# Altium project Hospital-Smart-Bracelet.PrjPcb
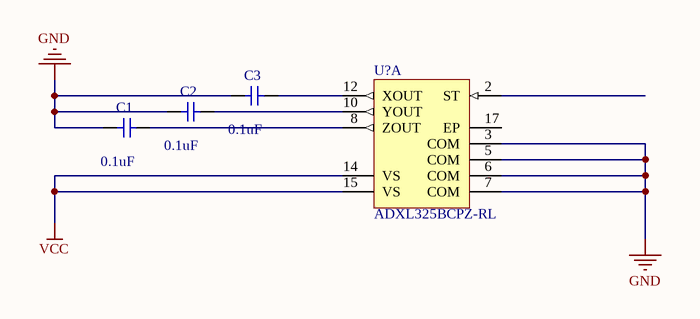
[diagram p0: SensorCaida.SchDoc]
7 sheets, 14 parts. Net scope: global (net labels, ports and power ports of the same name join across sheets).
Board file: HSB-Version1.PcbDoc
Sheets:
  SensorCaida.SchDoc
  Temperatura.SchDoc
  Atmega328P.SchDoc
  Proximidad.SchDoc
  CargaInalambrica.SchDoc
  BLE-HM10.SchDoc
  PPM.SchDoc

## Sheet SensorCaida.SchDoc
size A4

### Parts
(Parts that share a designator on the sheet are numbered #1, #2 ... from top to bottom, then left to right.)
C1  value 0.1uF  [C1206-1.00]  (hidden comment: C)
C2  value 0.1uF  [C1206-1.00]  (hidden comment: C)
C3  value 0.1uF  [C1206-1.00]  (hidden comment: C)
U?#1  ADXL325BCPZ-RL  [ADI-CP-16-5a_N]  (part A of 2)

### Nets
GND: C2.2 C3.2 U?#1.3(COM) U?#1.5(COM) U?#1.6(COM) U?#1.7(COM)
VCC: U?#1.14(VS) U?#1.15(VS)  [project net 3.3V]
NetC1_1: C1.1 U?#1.8(ZOUT)
NetC2_1: C2.1 U?#1.10(YOUT)
NetC3_1: C3.1 U?#1.12(XOUT)

Not connected (* = marked no-connect by the designer): C1 2; U?#1 2(ST) 17(EP)

### Library data of the parts
C1-C3 = C: Capacitor, generic
U?#1 = ADXL325BCPZ-RL: Small, Low Power, 3-Axis +/-5 g Accelerometer with Analog Output, 1.6 KHz BW, Industrial, 16-pin QFN, Reel; Manufacturer: Analog Devices; # of Axes: 3; -3dB Bandwidth: 1.6 KHz; Sensitivity: 174 mV/g; Supply Current: 350 uA; Voltage Supply (V): 1.8 to 3.6; DatasheetVersion: Rev. 0; PackageVersion: 072606-0, 07/2006; PackageReference: CP-16-5a; PackageDescription: 16-Pin Lead Frame Chip Scale Package, 4 x 4 mm Body, 0.65 mm Pitch; Supplier 1: Digi-Key; Supplier Part Number 1: ADXL325BCPZ-RL-ND; Supplier 2: Mouser; Supplier Part Number 2: 584-ADXL325BCPZ-R; Output Type: Analog; Packing: Reel; Mounting Technology: Surface Mount; PartNumber: ADXL325BCPZ-RL; ComponentLink1Description: Manufacturer URL; ComponentLink1URL: http://www.analog.com/en/index.html; ComponentLink2Description: Datasheet; ComponentLink2URL: http://www.analog.com/static/imported-files/data_sheets/ADXL325.pdf; ComponentLink3Description: Package Specification; ComponentLink3URL: http:/www.analog.com/static/imported-files/packages/45789401034275374892178CP_16_5a.pdf; ComponentLink4Description: Product URL; ComponentLink4URL: http://www.analog.com/en/mems-sensors/mems-inertial-sensors/adxl325/products/product.html

## Sheet Temperatura.SchDoc
size A4
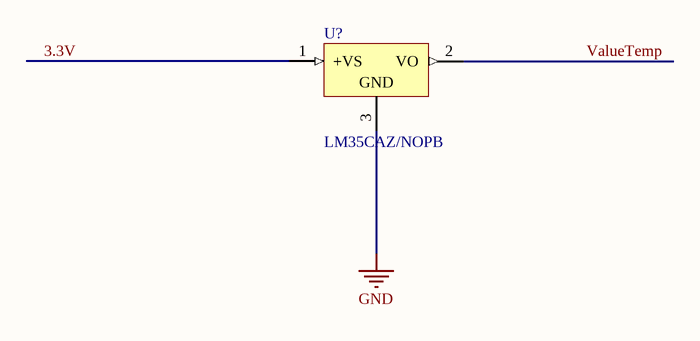
[diagram p1: Temperatura.SchDoc]

### Parts
(Parts that share a designator on the sheet are numbered #1, #2 ... from top to bottom, then left to right.)
U?#2  LM35CAZ/NOPB  [Z03A]

### Nets
3.3V: U?#2.1(+VS)
GND: U?#2.3(GND)
ValueTemp: U?#2.2(VO)  [project net A1]

### Library data of the parts
U?#2 = LM35CAZ/NOPB: Precision Centigrade Temperature Sensor, 3-pin TO-92, Pb-Free; Manufacturer: National Semiconductor; PackageTopMarking: NSXYTT*LM35*CAZ; PowerWise: N; CompType: Temp Sensor IC; Published: 1-Mar-2010; DatasheetVersion: Nov-2000; PackageVersion: revG, Sep-2000; PackageReference: Z03A; Publisher: Altium Limited; PackageDescription: TO-92, Molded, 3 Lead; Supplier 1: Digi-Key; Supplier Part Number 1: LM35CAZ-ND; Supplier 2: Farnell; Supplier Part Number 2: 1469232; PartNumber: LM35CAZ/NOPB; RoHS: Y; PinCount: 3; Code_JEDEC: TO-226-AA; ComponentLink1Description: LM35 Datasheet; ComponentLink1URL: http://www.national.com/ds/LM/LM35.pdf; ComponentLink2Description: LM35 Web Page; ComponentLink2URL: http://www.national.com/pf/LM/LM35.html; ComponentLink3Description: Z03A Package Page; ComponentLink3URL: http://www.national.com/packaging/folders/z03a.html

## Sheet Atmega328P.SchDoc
size A4
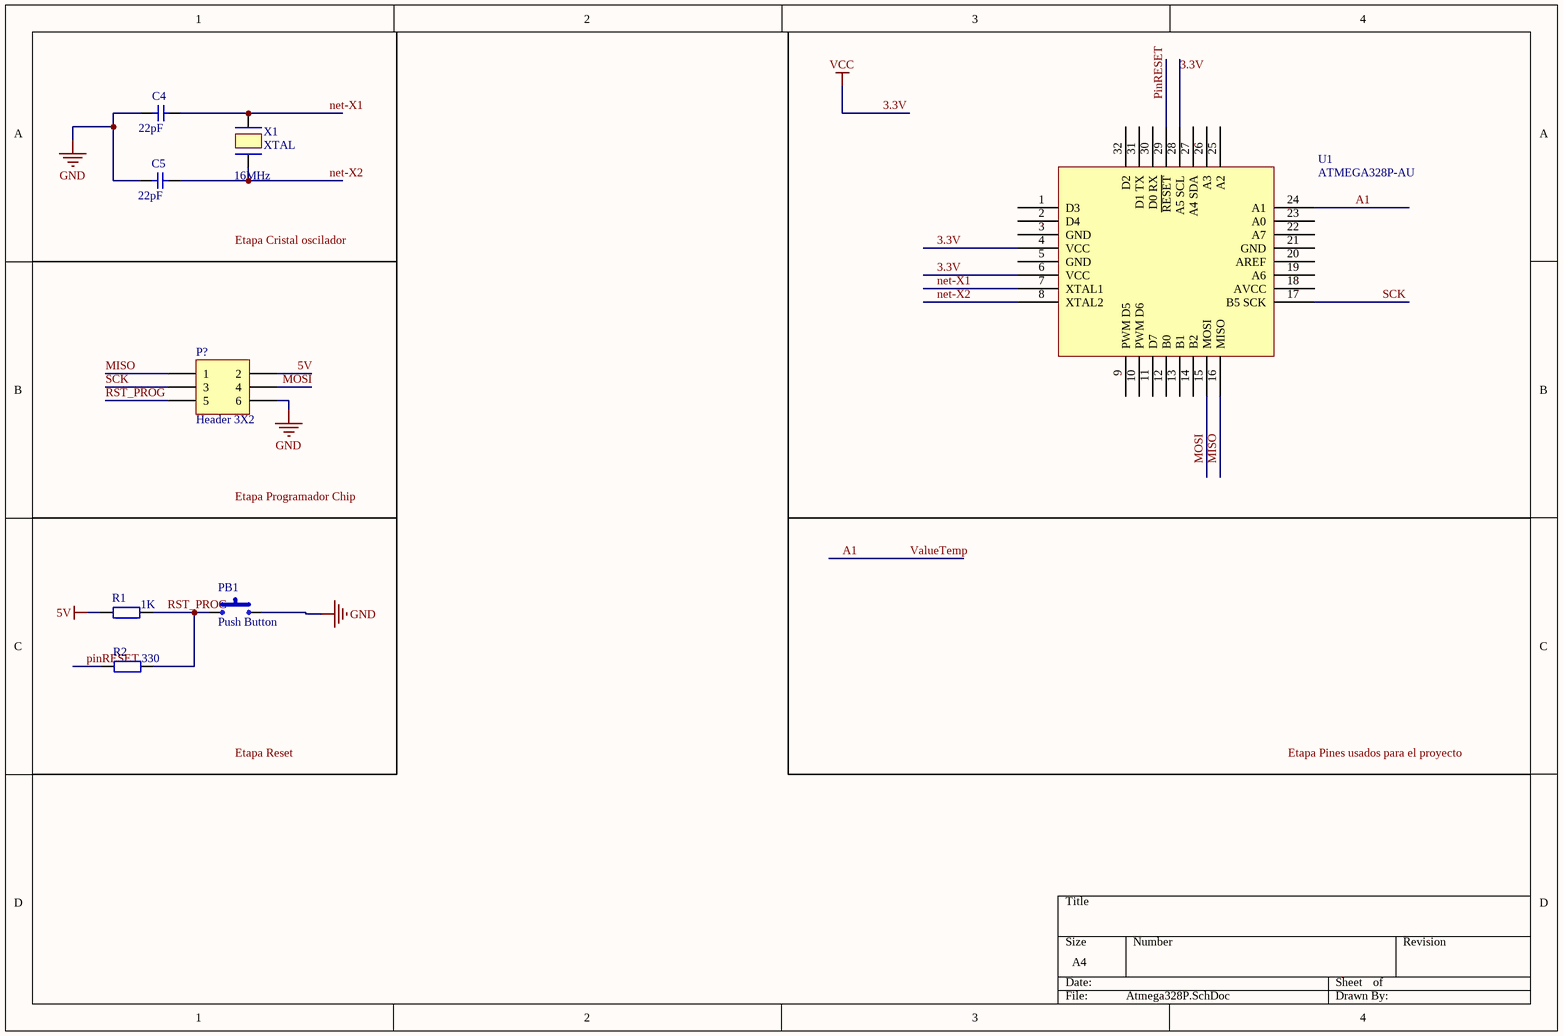
[diagram p2: Atmega328P.SchDoc]

### Parts
C4  value 22pF  [C1206-1.25]  (hidden comment: C1)
C5  value 22pF  [C1206-1.25]  (hidden comment: C2)
P?  Header 3X2  [HDR2X3]
PB1  Push Button  [Tack Switch 6x6 1mm TH]
R1  value 1K  [R1206-0.55]  (hidden comment: R)
R2  value 330  [R1206-0.55]  (hidden comment: R)
U1  ATMEGA328P-AU  [TQFP80P900X900X120-32N]
X1  XTAL  value 16MHz  [2-SMD]

### Nets
3.3V: U1.4(VCC) U1.6(VCC) U1.28(A5_SCL)  [also labelled VCC]
5V: P?.2 R1.1
GND: C4.1 C5.1 P?.6 PB1.2
A1: U1.24(A1)  [also labelled ValueTemp]
MISO: P?.1 U1.16(MISO)
MOSI: P?.4 U1.15(MOSI)
net-X1: C4.2 U1.7(XTAL1) X1.2
net-X2: C5.2 U1.8(XTAL2) X1.1
pinRESET: R2.1 U1.29(~{RESET})
RST_PROG: P?.5 PB1.1 R1.2 R2.2
SCK: P?.3 U1.17(B5_SCK)

Not connected (* = marked no-connect by the designer): U1 1(D3) 2(D4) 3(GND) 5(GND) 9(PWM_D5) 10(PWM_D6) 11(D7) 12(B0) 13(B1) 14(B2) 18(AVCC) 19(A6) 20(AREF) 21(GND) 22(A7) 23(A0) 25(A2) 26(A3) 27(A4_SDA) 30(D0_RX) 31(D1_TX) 32(D2)

### Notes on the sheet
- Labels drawn without touching a wire or pin: Etapa Cristal oscilador, Etapa Pines usados para el proyecto, Etapa Programador Chip, Etapa Reset

### Library data of the parts
C4 C5 = C: Capacitor, generic
P? = Header 3X2: Header, 3-Pin, Dual row; LatestRevisionDate: 17-Jul-2002; LatestRevisionNote: Re-released for DXP Platform.; Publisher: Altium Limited
R1 R2 = R: Resistor, generic
U1 = ATMEGA328P-AU: Microchip Technology ATMEGA328P-AN, 8bit AVR Microcontroller, 20MHz, 32 kB Flash, 32-Pin TQFP; Company: Gueni; Created By: Mohamed Gueni; Date: 20 October 2018; RS Stock No: 131-0271; Datasheet URL: https://docs-emea.rs-online.com/webdocs/15b8/0900766b815b8e7b.pdf
X1 = XTAL: Crystal, Generic

## Sheet Proximidad.SchDoc
size A4

## Sheet CargaInalambrica.SchDoc
size A4

## Sheet BLE-HM10.SchDoc
size A4
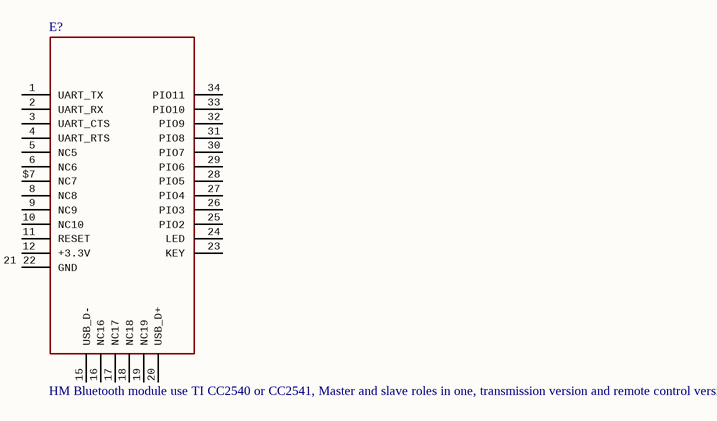
[diagram p3: BLE-HM10.SchDoc]

### Parts
E?  HM Bluetooth module use TI CC2540 or CC2541, Master and slave roles in one, transmission version and remote control version and PIO state acquisition functions in one, Support the AT command modify module parameters, Convenient and flexible.  [26.9X13X2.2_BOARD]

### Nets

Not connected (* = marked no-connect by the designer): E? 1(UART_TX) 2(UART_RX) 3(UART_CTS) 4(UART_RTS) 5(NC5) 6(NC6) 8(NC8) 9(NC9) 10(NC10) 11(RESET) 12(+3.3V) 13 14 21 22(GND) 15(USB_D-) 16(NC16) 17(NC17) 18(NC18) 19(NC19) 20(USB_D+) 23(KEY) 24(LED) 25(PIO2) 26(PIO3) 27(PIO4) 28(PIO5) 29(PIO6) 30(PIO7) 31(PIO8) 32(PIO9) 33(PIO10) 34(PIO11) $7(NC7)

### Library data of the parts
E? = HM-10-BOARD

## Sheet PPM.SchDoc
size A4

## Nets that join several sheets
3.3V: SensorCaida (U?#1.14 U?#1.15), Temperatura (U?#2.1), Atmega328P (U1.4 U1.6 U1.28)
GND: SensorCaida (6 pins), Temperatura (U?#2.3), Atmega328P (C4.1 C5.1 P?.6 PB1.2)
A1: Temperatura (U?#2.2), Atmega328P (U1.24)